# Vivado block design bd_0cc7, xc7z010clg400-1, Vivado 2020.2
# (continued, part 2 of 2)
current_bd_instance /m01_nodes

# ---- hierarchy /m01_exit_pipeline ----
current_bd_instance /m01_exit_pipeline
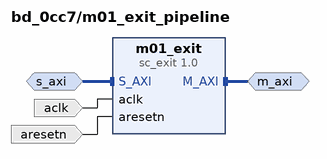
[diagram p9: block diagram inside /m01_exit_pipeline]
create_bd_intf_pin -mode Slave -vlnv xilinx.com:interface:aximm_rtl:1.0 s_axi
create_bd_intf_pin -mode Master -vlnv xilinx.com:interface:aximm_rtl:1.0 m_axi
create_bd_pin -dir I -type clk aclk
create_bd_pin -dir I -type rst aresetn

create_bd_cell -type ip -vlnv xilinx.com:ip:sc_exit:1.0 m01_exit
set_property -dict [list \
  CONFIG.ADDR_WIDTH 12 \
  CONFIG.ENABLE_PIPELINING 0 \
  CONFIG.HAS_BURST 0 \
  CONFIG.IS_CASCADED 0 \
  CONFIG.MEP_IDENTIFIER_WIDTH 1 \
  CONFIG.M_MAX_BURST_LENGTH 0 \
  CONFIG.M_PROTOCOL AXI4LITE \
  CONFIG.NUM_MSC 3 \
  CONFIG.NUM_READ_OUTSTANDING 8 \
  CONFIG.NUM_WRITE_OUTSTANDING 8 \
  CONFIG.RDATA_WIDTH 32 \
  CONFIG.READ_WRITE_MODE READ_WRITE \
  CONFIG.SINGLE_ISSUING 1 \
  CONFIG.SSC000_ROUTE 0b101 \
  CONFIG.SSC001_ROUTE 0b111 \
  CONFIG.SSC_ROUTE_WIDTH 3 \
  CONFIG.S_ID_WIDTH 1 \
  CONFIG.WDATA_WIDTH 32 \
] [get_bd_cells m01_exit]

# ---- hierarchy /m02_nodes ----
current_bd_instance /m02_nodes
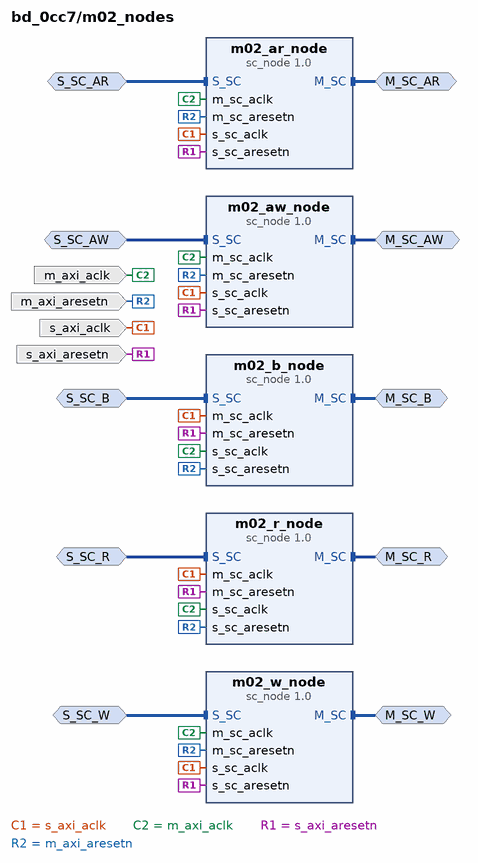
[diagram p10: block diagram inside /m02_nodes]
create_bd_intf_pin -mode Master -vlnv xilinx.com:interface:sc_rtl:1.0 M_SC_AR
create_bd_intf_pin -mode Slave -vlnv xilinx.com:interface:sc_rtl:1.0 S_SC_AR
create_bd_intf_pin -mode Master -vlnv xilinx.com:interface:sc_rtl:1.0 M_SC_R
create_bd_intf_pin -mode Slave -vlnv xilinx.com:interface:sc_rtl:1.0 S_SC_R
create_bd_intf_pin -mode Master -vlnv xilinx.com:interface:sc_rtl:1.0 M_SC_AW
create_bd_intf_pin -mode Slave -vlnv xilinx.com:interface:sc_rtl:1.0 S_SC_AW
create_bd_intf_pin -mode Master -vlnv xilinx.com:interface:sc_rtl:1.0 M_SC_W
create_bd_intf_pin -mode Slave -vlnv xilinx.com:interface:sc_rtl:1.0 S_SC_W
create_bd_intf_pin -mode Master -vlnv xilinx.com:interface:sc_rtl:1.0 M_SC_B
create_bd_intf_pin -mode Slave -vlnv xilinx.com:interface:sc_rtl:1.0 S_SC_B
create_bd_pin -dir I -type clk s_axi_aclk
create_bd_pin -dir I -type rst s_axi_aresetn
create_bd_pin -dir I -type clk m_axi_aclk
create_bd_pin -dir I -type rst m_axi_aresetn

create_bd_cell -type ip -vlnv xilinx.com:ip:sc_node:1.0 m02_ar_node
set_property -dict [list \
  CONFIG.ACLK_RELATIONSHIP 1 \
  CONFIG.ADDR_WIDTH 18 \
  CONFIG.CHANNEL 2 \
  CONFIG.FIFO_TYPE 2 \
  CONFIG.ID_WIDTH 1 \
  CONFIG.M00_NUM_BYTES 4 \
  CONFIG.M01_NUM_BYTES 4 \
  CONFIG.M02_NUM_BYTES 4 \
  CONFIG.M03_NUM_BYTES 4 \
  CONFIG.M04_NUM_BYTES 4 \
  CONFIG.M05_NUM_BYTES 4 \
  CONFIG.M06_NUM_BYTES 4 \
  CONFIG.M07_NUM_BYTES 4 \
  CONFIG.M08_NUM_BYTES 4 \
  CONFIG.M09_NUM_BYTES 4 \
  CONFIG.M10_NUM_BYTES 4 \
  CONFIG.M11_NUM_BYTES 4 \
  CONFIG.M12_NUM_BYTES 4 \
  CONFIG.M13_NUM_BYTES 4 \
  CONFIG.M14_NUM_BYTES 4 \
  CONFIG.M15_NUM_BYTES 4 \
  CONFIG.MAX_PAYLD_BYTES 4 \
  CONFIG.M_SEND_PIPELINE 0 \
  CONFIG.NUM_MI 1 \
  CONFIG.NUM_OUTSTANDING 8 \
  CONFIG.NUM_SI 1 \
  CONFIG.PAYLD_WIDTH 128 \
  CONFIG.S00_NUM_BYTES 4 \
  CONFIG.S01_NUM_BYTES 4 \
  CONFIG.S02_NUM_BYTES 4 \
  CONFIG.S03_NUM_BYTES 4 \
  CONFIG.S04_NUM_BYTES 4 \
  CONFIG.S05_NUM_BYTES 4 \
  CONFIG.S06_NUM_BYTES 4 \
  CONFIG.S07_NUM_BYTES 4 \
  CONFIG.S08_NUM_BYTES 4 \
  CONFIG.S09_NUM_BYTES 4 \
  CONFIG.S10_NUM_BYTES 4 \
  CONFIG.S11_NUM_BYTES 4 \
  CONFIG.S12_NUM_BYTES 4 \
  CONFIG.S13_NUM_BYTES 4 \
  CONFIG.S14_NUM_BYTES 4 \
  CONFIG.S15_NUM_BYTES 4 \
  CONFIG.SC_ROUTE_WIDTH 5 \
  CONFIG.USER_WIDTH 0 \
] [get_bd_cells m02_ar_node]
create_bd_cell -type ip -vlnv xilinx.com:ip:sc_node:1.0 m02_r_node
set_property -dict [list \
  CONFIG.ACLK_RELATIONSHIP 1 \
  CONFIG.ADDR_WIDTH 18 \
  CONFIG.CHANNEL 0 \
  CONFIG.FIFO_TYPE 2 \
  CONFIG.ID_WIDTH 1 \
  CONFIG.M00_NUM_BYTES 4 \
  CONFIG.M01_NUM_BYTES 4 \
  CONFIG.M02_NUM_BYTES 4 \
  CONFIG.M03_NUM_BYTES 4 \
  CONFIG.M04_NUM_BYTES 4 \
  CONFIG.M05_NUM_BYTES 4 \
  CONFIG.M06_NUM_BYTES 4 \
  CONFIG.M07_NUM_BYTES 4 \
  CONFIG.M08_NUM_BYTES 4 \
  CONFIG.M09_NUM_BYTES 4 \
  CONFIG.M10_NUM_BYTES 4 \
  CONFIG.M11_NUM_BYTES 4 \
  CONFIG.M12_NUM_BYTES 4 \
  CONFIG.M13_NUM_BYTES 4 \
  CONFIG.M14_NUM_BYTES 4 \
  CONFIG.M15_NUM_BYTES 4 \
  CONFIG.MAX_PAYLD_BYTES 4 \
  CONFIG.NUM_MI 1 \
  CONFIG.NUM_OUTSTANDING 8 \
  CONFIG.NUM_SI 1 \
  CONFIG.PAYLD_WIDTH 53 \
  CONFIG.S00_NUM_BYTES 4 \
  CONFIG.S01_NUM_BYTES 4 \
  CONFIG.S02_NUM_BYTES 4 \
  CONFIG.S03_NUM_BYTES 4 \
  CONFIG.S04_NUM_BYTES 4 \
  CONFIG.S05_NUM_BYTES 4 \
  CONFIG.S06_NUM_BYTES 4 \
  CONFIG.S07_NUM_BYTES 4 \
  CONFIG.S08_NUM_BYTES 4 \
  CONFIG.S09_NUM_BYTES 4 \
  CONFIG.S10_NUM_BYTES 4 \
  CONFIG.S11_NUM_BYTES 4 \
  CONFIG.S12_NUM_BYTES 4 \
  CONFIG.S13_NUM_BYTES 4 \
  CONFIG.S14_NUM_BYTES 4 \
  CONFIG.S15_NUM_BYTES 4 \
  CONFIG.SC_ROUTE_WIDTH 3 \
  CONFIG.USER_BITS_PER_BYTE 0 \
  CONFIG.USER_WIDTH 0 \
] [get_bd_cells m02_r_node]
create_bd_cell -type ip -vlnv xilinx.com:ip:sc_node:1.0 m02_aw_node
set_property -dict [list \
  CONFIG.ACLK_RELATIONSHIP 1 \
  CONFIG.ADDR_WIDTH 18 \
  CONFIG.CHANNEL 3 \
  CONFIG.FIFO_TYPE 2 \
  CONFIG.ID_WIDTH 1 \
  CONFIG.M00_NUM_BYTES 4 \
  CONFIG.M01_NUM_BYTES 4 \
  CONFIG.M02_NUM_BYTES 4 \
  CONFIG.M03_NUM_BYTES 4 \
  CONFIG.M04_NUM_BYTES 4 \
  CONFIG.M05_NUM_BYTES 4 \
  CONFIG.M06_NUM_BYTES 4 \
  CONFIG.M07_NUM_BYTES 4 \
  CONFIG.M08_NUM_BYTES 4 \
  CONFIG.M09_NUM_BYTES 4 \
  CONFIG.M10_NUM_BYTES 4 \
  CONFIG.M11_NUM_BYTES 4 \
  CONFIG.M12_NUM_BYTES 4 \
  CONFIG.M13_NUM_BYTES 4 \
  CONFIG.M14_NUM_BYTES 4 \
  CONFIG.M15_NUM_BYTES 4 \
  CONFIG.MAX_PAYLD_BYTES 4 \
  CONFIG.M_SEND_PIPELINE 0 \
  CONFIG.NUM_MI 1 \
  CONFIG.NUM_OUTSTANDING 8 \
  CONFIG.NUM_SI 1 \
  CONFIG.PAYLD_WIDTH 128 \
  CONFIG.S00_NUM_BYTES 4 \
  CONFIG.S01_NUM_BYTES 4 \
  CONFIG.S02_NUM_BYTES 4 \
  CONFIG.S03_NUM_BYTES 4 \
  CONFIG.S04_NUM_BYTES 4 \
  CONFIG.S05_NUM_BYTES 4 \
  CONFIG.S06_NUM_BYTES 4 \
  CONFIG.S07_NUM_BYTES 4 \
  CONFIG.S08_NUM_BYTES 4 \
  CONFIG.S09_NUM_BYTES 4 \
  CONFIG.S10_NUM_BYTES 4 \
  CONFIG.S11_NUM_BYTES 4 \
  CONFIG.S12_NUM_BYTES 4 \
  CONFIG.S13_NUM_BYTES 4 \
  CONFIG.S14_NUM_BYTES 4 \
  CONFIG.S15_NUM_BYTES 4 \
  CONFIG.SC_ROUTE_WIDTH 5 \
  CONFIG.USER_WIDTH 0 \
] [get_bd_cells m02_aw_node]
create_bd_cell -type ip -vlnv xilinx.com:ip:sc_node:1.0 m02_w_node
set_property -dict [list \
  CONFIG.ACLK_RELATIONSHIP 1 \
  CONFIG.ADDR_WIDTH 18 \
  CONFIG.CHANNEL 1 \
  CONFIG.FIFO_TYPE 2 \
  CONFIG.ID_WIDTH 1 \
  CONFIG.M00_NUM_BYTES 4 \
  CONFIG.M01_NUM_BYTES 4 \
  CONFIG.M02_NUM_BYTES 4 \
  CONFIG.M03_NUM_BYTES 4 \
  CONFIG.M04_NUM_BYTES 4 \
  CONFIG.M05_NUM_BYTES 4 \
  CONFIG.M06_NUM_BYTES 4 \
  CONFIG.M07_NUM_BYTES 4 \
  CONFIG.M08_NUM_BYTES 4 \
  CONFIG.M09_NUM_BYTES 4 \
  CONFIG.M10_NUM_BYTES 4 \
  CONFIG.M11_NUM_BYTES 4 \
  CONFIG.M12_NUM_BYTES 4 \
  CONFIG.M13_NUM_BYTES 4 \
  CONFIG.M14_NUM_BYTES 4 \
  CONFIG.M15_NUM_BYTES 4 \
  CONFIG.MAX_PAYLD_BYTES 4 \
  CONFIG.M_SEND_PIPELINE 0 \
  CONFIG.NUM_MI 1 \
  CONFIG.NUM_OUTSTANDING 8 \
  CONFIG.NUM_SI 1 \
  CONFIG.PAYLD_WIDTH 56 \
  CONFIG.S00_NUM_BYTES 4 \
  CONFIG.S01_NUM_BYTES 4 \
  CONFIG.S02_NUM_BYTES 4 \
  CONFIG.S03_NUM_BYTES 4 \
  CONFIG.S04_NUM_BYTES 4 \
  CONFIG.S05_NUM_BYTES 4 \
  CONFIG.S06_NUM_BYTES 4 \
  CONFIG.S07_NUM_BYTES 4 \
  CONFIG.S08_NUM_BYTES 4 \
  CONFIG.S09_NUM_BYTES 4 \
  CONFIG.S10_NUM_BYTES 4 \
  CONFIG.S11_NUM_BYTES 4 \
  CONFIG.S12_NUM_BYTES 4 \
  CONFIG.S13_NUM_BYTES 4 \
  CONFIG.S14_NUM_BYTES 4 \
  CONFIG.S15_NUM_BYTES 4 \
  CONFIG.SC_ROUTE_WIDTH 5 \
  CONFIG.USER_BITS_PER_BYTE 0 \
  CONFIG.USER_WIDTH 0 \
] [get_bd_cells m02_w_node]
create_bd_cell -type ip -vlnv xilinx.com:ip:sc_node:1.0 m02_b_node
set_property -dict [list \
  CONFIG.ACLK_RELATIONSHIP 1 \
  CONFIG.ADDR_WIDTH 18 \
  CONFIG.CHANNEL 4 \
  CONFIG.FIFO_TYPE 2 \
  CONFIG.ID_WIDTH 1 \
  CONFIG.M00_NUM_BYTES 4 \
  CONFIG.M01_NUM_BYTES 4 \
  CONFIG.M02_NUM_BYTES 4 \
  CONFIG.M03_NUM_BYTES 4 \
  CONFIG.M04_NUM_BYTES 4 \
  CONFIG.M05_NUM_BYTES 4 \
  CONFIG.M06_NUM_BYTES 4 \
  CONFIG.M07_NUM_BYTES 4 \
  CONFIG.M08_NUM_BYTES 4 \
  CONFIG.M09_NUM_BYTES 4 \
  CONFIG.M10_NUM_BYTES 4 \
  CONFIG.M11_NUM_BYTES 4 \
  CONFIG.M12_NUM_BYTES 4 \
  CONFIG.M13_NUM_BYTES 4 \
  CONFIG.M14_NUM_BYTES 4 \
  CONFIG.M15_NUM_BYTES 4 \
  CONFIG.MAX_PAYLD_BYTES 4 \
  CONFIG.NUM_MI 1 \
  CONFIG.NUM_OUTSTANDING 8 \
  CONFIG.NUM_SI 1 \
  CONFIG.PAYLD_WIDTH 7 \
  CONFIG.S00_NUM_BYTES 4 \
  CONFIG.S01_NUM_BYTES 4 \
  CONFIG.S02_NUM_BYTES 4 \
  CONFIG.S03_NUM_BYTES 4 \
  CONFIG.S04_NUM_BYTES 4 \
  CONFIG.S05_NUM_BYTES 4 \
  CONFIG.S06_NUM_BYTES 4 \
  CONFIG.S07_NUM_BYTES 4 \
  CONFIG.S08_NUM_BYTES 4 \
  CONFIG.S09_NUM_BYTES 4 \
  CONFIG.S10_NUM_BYTES 4 \
  CONFIG.S11_NUM_BYTES 4 \
  CONFIG.S12_NUM_BYTES 4 \
  CONFIG.S13_NUM_BYTES 4 \
  CONFIG.S14_NUM_BYTES 4 \
  CONFIG.S15_NUM_BYTES 4 \
  CONFIG.SC_ROUTE_WIDTH 3 \
  CONFIG.USER_WIDTH 0 \
] [get_bd_cells m02_b_node]

# ---- hierarchy /m02_exit_pipeline ----
current_bd_instance /m02_exit_pipeline
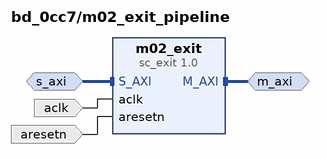
[diagram p11: block diagram inside /m02_exit_pipeline]
create_bd_intf_pin -mode Slave -vlnv xilinx.com:interface:aximm_rtl:1.0 s_axi
create_bd_intf_pin -mode Master -vlnv xilinx.com:interface:aximm_rtl:1.0 m_axi
create_bd_pin -dir I -type clk aclk
create_bd_pin -dir I -type rst aresetn

create_bd_cell -type ip -vlnv xilinx.com:ip:sc_exit:1.0 m02_exit
set_property -dict [list \
  CONFIG.ADDR_WIDTH 9 \
  CONFIG.ENABLE_PIPELINING 0 \
  CONFIG.HAS_BURST 0 \
  CONFIG.IS_CASCADED 0 \
  CONFIG.MEP_IDENTIFIER_WIDTH 1 \
  CONFIG.M_MAX_BURST_LENGTH 0 \
  CONFIG.M_PROTOCOL AXI4LITE \
  CONFIG.NUM_MSC 3 \
  CONFIG.NUM_READ_OUTSTANDING 8 \
  CONFIG.NUM_WRITE_OUTSTANDING 8 \
  CONFIG.RDATA_WIDTH 32 \
  CONFIG.READ_WRITE_MODE READ_WRITE \
  CONFIG.SINGLE_ISSUING 1 \
  CONFIG.SSC000_ROUTE 0b101 \
  CONFIG.SSC001_ROUTE 0b111 \
  CONFIG.SSC_ROUTE_WIDTH 3 \
  CONFIG.S_ID_WIDTH 1 \
  CONFIG.WDATA_WIDTH 32 \
] [get_bd_cells m02_exit]

# ---- connections ----

current_bd_instance /clk_map
connect_bd_net -net clk_map_aresetn_net [get_bd_pins aresetn] [get_bd_pins psr_aclk/aux_reset_in]
connect_bd_net -net clk_map_aclk_net [get_bd_pins aclk] \
  [get_bd_pins S00_ACLK] [get_bd_pins M00_ACLK] [get_bd_pins M01_ACLK] [get_bd_pins M02_ACLK] [get_bd_pins swbd_aclk] \
  [get_bd_pins psr_aclk/slowest_sync_clk]
connect_bd_net [get_bd_pins psr_aclk/interconnect_aresetn] \
  [get_bd_pins S00_ARESETN] [get_bd_pins M00_ARESETN] [get_bd_pins M01_ARESETN] [get_bd_pins M02_ARESETN] \
  [get_bd_pins swbd_aresetn]
connect_bd_net [get_bd_pins one/dout] [get_bd_pins psr_aclk/ext_reset_in]

current_bd_instance /switchboards
connect_bd_intf_net [get_bd_intf_pins M00_SC_AW] [get_bd_intf_pins aw_la_out_swbd/M00_SC]
connect_bd_intf_net [get_bd_intf_pins S00_SC_AR] [get_bd_intf_pins ar_la_in_swbd/S00_SC]
connect_bd_intf_net [get_bd_intf_pins M00_SC_R] [get_bd_intf_pins r_la_in_swbd/M00_SC]
connect_bd_intf_net [get_bd_intf_pins M00_SC_AR] [get_bd_intf_pins ar_la_out_swbd/M00_SC]
connect_bd_intf_net [get_bd_intf_pins M02_SC_AR] [get_bd_intf_pins ar_la_out_swbd/M02_SC]
connect_bd_intf_net [get_bd_intf_pins M01_SC_AR] [get_bd_intf_pins ar_la_out_swbd/M01_SC]
connect_bd_intf_net [get_bd_intf_pins S00_SC_W] [get_bd_intf_pins w_la_in_swbd/S00_SC]
connect_bd_intf_net [get_bd_intf_pins S00_SC_AW] [get_bd_intf_pins aw_la_in_swbd/S00_SC]
connect_bd_intf_net [get_bd_intf_pins M00_SC_B] [get_bd_intf_pins b_la_in_swbd/M00_SC]
connect_bd_intf_net [get_bd_intf_pins M01_SC_AW] [get_bd_intf_pins aw_la_out_swbd/M01_SC]
connect_bd_intf_net [get_bd_intf_pins M02_SC_W] [get_bd_intf_pins w_la_out_swbd/M02_SC]
connect_bd_intf_net [get_bd_intf_pins S00_SC_B] [get_bd_intf_pins b_la_out_swbd/S00_SC]
connect_bd_intf_net [get_bd_intf_pins S02_SC_B] [get_bd_intf_pins b_la_out_swbd/S02_SC]
connect_bd_intf_net [get_bd_intf_pins S01_SC_B] [get_bd_intf_pins b_la_out_swbd/S01_SC]
connect_bd_intf_net [get_bd_intf_pins S00_SC_R] [get_bd_intf_pins r_la_out_swbd/S00_SC]
connect_bd_intf_net [get_bd_intf_pins S01_SC_R] [get_bd_intf_pins r_la_out_swbd/S01_SC]
connect_bd_intf_net [get_bd_intf_pins M02_SC_AW] [get_bd_intf_pins aw_la_out_swbd/M02_SC]
connect_bd_intf_net [get_bd_intf_pins S02_SC_R] [get_bd_intf_pins r_la_out_swbd/S02_SC]
connect_bd_intf_net [get_bd_intf_pins M00_SC_W] [get_bd_intf_pins w_la_out_swbd/M00_SC]
connect_bd_intf_net [get_bd_intf_pins M01_SC_W] [get_bd_intf_pins w_la_out_swbd/M01_SC]
connect_bd_intf_net [get_bd_intf_pins b_la_out_swbd/M00_SC] [get_bd_intf_pins i_nodes/S_SC_B]
connect_bd_intf_net [get_bd_intf_pins r_la_in_swbd/S00_SC] [get_bd_intf_pins i_nodes/M_SC_R]
connect_bd_intf_net [get_bd_intf_pins b_la_in_swbd/S00_SC] [get_bd_intf_pins i_nodes/M_SC_B]
connect_bd_intf_net [get_bd_intf_pins r_la_out_swbd/M00_SC] [get_bd_intf_pins i_nodes/S_SC_R]
connect_bd_intf_net [get_bd_intf_pins aw_la_in_swbd/M00_SC] [get_bd_intf_pins i_nodes/S_SC_AW]
connect_bd_intf_net [get_bd_intf_pins w_la_out_swbd/S00_SC] [get_bd_intf_pins i_nodes/M_SC_W]
connect_bd_intf_net [get_bd_intf_pins ar_la_out_swbd/S00_SC] [get_bd_intf_pins i_nodes/M_SC_AR]
connect_bd_intf_net [get_bd_intf_pins ar_la_in_swbd/M00_SC] [get_bd_intf_pins i_nodes/S_SC_AR]
connect_bd_intf_net [get_bd_intf_pins aw_la_out_swbd/S00_SC] [get_bd_intf_pins i_nodes/M_SC_AW]
connect_bd_intf_net [get_bd_intf_pins w_la_in_swbd/M00_SC] [get_bd_intf_pins i_nodes/S_SC_W]
connect_bd_net [get_bd_pins s_sc_aclk] \
  [get_bd_pins i_nodes/s_sc_aclk] [get_bd_pins ar_la_in_swbd/aclk] [get_bd_pins aw_la_in_swbd/aclk] \
  [get_bd_pins b_la_in_swbd/aclk] [get_bd_pins r_la_in_swbd/aclk] [get_bd_pins w_la_in_swbd/aclk]
connect_bd_net [get_bd_pins m_sc_aclk] \
  [get_bd_pins i_nodes/m_sc_aclk] [get_bd_pins ar_la_out_swbd/aclk] [get_bd_pins aw_la_out_swbd/aclk] \
  [get_bd_pins b_la_out_swbd/aclk] [get_bd_pins r_la_out_swbd/aclk] [get_bd_pins w_la_out_swbd/aclk]
connect_bd_net [get_bd_pins s_sc_aresetn] [get_bd_pins i_nodes/s_sc_aresetn]
connect_bd_net [get_bd_pins m_sc_aresetn] [get_bd_pins i_nodes/m_sc_aresetn]

current_bd_instance /switchboards/i_nodes
connect_bd_intf_net [get_bd_intf_pins M_SC_R] [get_bd_intf_pins i_r_node/M_SC]
connect_bd_intf_net [get_bd_intf_pins M_SC_AR] [get_bd_intf_pins i_ar_node/M_SC]
connect_bd_intf_net [get_bd_intf_pins S_SC_AR] [get_bd_intf_pins i_ar_node/S_SC]
connect_bd_intf_net [get_bd_intf_pins S_SC_R] [get_bd_intf_pins i_r_node/S_SC]
connect_bd_intf_net [get_bd_intf_pins S_SC_AW] [get_bd_intf_pins i_aw_node/S_SC]
connect_bd_intf_net [get_bd_intf_pins S_SC_W] [get_bd_intf_pins i_w_node/S_SC]
connect_bd_intf_net [get_bd_intf_pins S_SC_B] [get_bd_intf_pins i_b_node/S_SC]
connect_bd_intf_net [get_bd_intf_pins M_SC_W] [get_bd_intf_pins i_w_node/M_SC]
connect_bd_intf_net [get_bd_intf_pins M_SC_AW] [get_bd_intf_pins i_aw_node/M_SC]
connect_bd_intf_net [get_bd_intf_pins M_SC_B] [get_bd_intf_pins i_b_node/M_SC]
connect_bd_net [get_bd_pins s_sc_aclk] \
  [get_bd_pins i_aw_node/s_sc_aclk] [get_bd_pins i_w_node/s_sc_aclk] [get_bd_pins i_ar_node/s_sc_aclk] \
  [get_bd_pins i_r_node/m_sc_aclk] [get_bd_pins i_b_node/m_sc_aclk]
connect_bd_net [get_bd_pins m_sc_aclk] \
  [get_bd_pins i_aw_node/m_sc_aclk] [get_bd_pins i_ar_node/m_sc_aclk] [get_bd_pins i_w_node/m_sc_aclk] \
  [get_bd_pins i_r_node/s_sc_aclk] [get_bd_pins i_b_node/s_sc_aclk]
connect_bd_net [get_bd_pins s_sc_aresetn] \
  [get_bd_pins i_aw_node/s_sc_aresetn] [get_bd_pins i_w_node/s_sc_aresetn] [get_bd_pins i_ar_node/s_sc_aresetn] \
  [get_bd_pins i_r_node/m_sc_aresetn] [get_bd_pins i_b_node/m_sc_aresetn]
connect_bd_net [get_bd_pins m_sc_aresetn] \
  [get_bd_pins i_aw_node/m_sc_aresetn] [get_bd_pins i_ar_node/m_sc_aresetn] [get_bd_pins i_w_node/m_sc_aresetn] \
  [get_bd_pins i_r_node/s_sc_aresetn] [get_bd_pins i_b_node/s_sc_aresetn]

current_bd_instance /s00_entry_pipeline
connect_bd_intf_net [get_bd_intf_pins s00_mmu/M_AXI] [get_bd_intf_pins s00_transaction_regulator/S_AXI]
connect_bd_intf_net [get_bd_intf_pins s00_transaction_regulator/M_AXI] [get_bd_intf_pins s00_si_converter/S_AXI]
connect_bd_intf_net [get_bd_intf_pins s_axi] [get_bd_intf_pins s00_mmu/S_AXI]
connect_bd_intf_net [get_bd_intf_pins m_axi] [get_bd_intf_pins s00_si_converter/M_AXI]
connect_bd_net [get_bd_pins aclk] [get_bd_pins s00_mmu/aclk] [get_bd_pins s00_si_converter/aclk] [get_bd_pins s00_transaction_regulator/aclk]
connect_bd_net [get_bd_pins aresetn] \
  [get_bd_pins s00_mmu/aresetn] [get_bd_pins s00_si_converter/aresetn] [get_bd_pins s00_transaction_regulator/aresetn]

current_bd_instance /s00_nodes
connect_bd_intf_net [get_bd_intf_pins S_SC_AR] [get_bd_intf_pins s00_ar_node/S_SC]
connect_bd_intf_net [get_bd_intf_pins M_SC_AR] [get_bd_intf_pins s00_ar_node/M_SC]
connect_bd_intf_net [get_bd_intf_pins M_SC_R] [get_bd_intf_pins s00_r_node/M_SC]
connect_bd_intf_net [get_bd_intf_pins M_SC_AW] [get_bd_intf_pins s00_aw_node/M_SC]
connect_bd_intf_net [get_bd_intf_pins S_SC_AW] [get_bd_intf_pins s00_aw_node/S_SC]
connect_bd_intf_net [get_bd_intf_pins S_SC_R] [get_bd_intf_pins s00_r_node/S_SC]
connect_bd_intf_net [get_bd_intf_pins M_SC_B] [get_bd_intf_pins s00_b_node/M_SC]
connect_bd_intf_net [get_bd_intf_pins S_SC_W] [get_bd_intf_pins s00_w_node/S_SC]
connect_bd_intf_net [get_bd_intf_pins M_SC_W] [get_bd_intf_pins s00_w_node/M_SC]
connect_bd_intf_net [get_bd_intf_pins S_SC_B] [get_bd_intf_pins s00_b_node/S_SC]
connect_bd_net [get_bd_pins s_sc_clk] \
  [get_bd_pins s00_ar_node/s_sc_aclk] [get_bd_pins s00_aw_node/s_sc_aclk] [get_bd_pins s00_w_node/s_sc_aclk] \
  [get_bd_pins s00_r_node/m_sc_aclk] [get_bd_pins s00_b_node/m_sc_aclk]
connect_bd_net [get_bd_pins m_sc_clk] \
  [get_bd_pins s00_ar_node/m_sc_aclk] [get_bd_pins s00_aw_node/m_sc_aclk] [get_bd_pins s00_w_node/m_sc_aclk] \
  [get_bd_pins s00_r_node/s_sc_aclk] [get_bd_pins s00_b_node/s_sc_aclk]
connect_bd_net [get_bd_pins s_sc_resetn] \
  [get_bd_pins s00_ar_node/s_sc_aresetn] [get_bd_pins s00_aw_node/s_sc_aresetn] [get_bd_pins s00_w_node/s_sc_aresetn] \
  [get_bd_pins s00_r_node/m_sc_aresetn] [get_bd_pins s00_b_node/m_sc_aresetn]
connect_bd_net [get_bd_pins m_sc_resetn] \
  [get_bd_pins s00_ar_node/m_sc_aresetn] [get_bd_pins s00_aw_node/m_sc_aresetn] [get_bd_pins s00_w_node/m_sc_aresetn] \
  [get_bd_pins s00_r_node/s_sc_aresetn] [get_bd_pins s00_b_node/s_sc_aresetn]

current_bd_instance /m00_nodes
connect_bd_intf_net [get_bd_intf_pins S_SC_AR] [get_bd_intf_pins m00_ar_node/S_SC]
connect_bd_intf_net [get_bd_intf_pins M_SC_AR] [get_bd_intf_pins m00_ar_node/M_SC]
connect_bd_intf_net [get_bd_intf_pins M_SC_AW] [get_bd_intf_pins m00_aw_node/M_SC]
connect_bd_intf_net [get_bd_intf_pins S_SC_R] [get_bd_intf_pins m00_r_node/S_SC]
connect_bd_intf_net [get_bd_intf_pins S_SC_AW] [get_bd_intf_pins m00_aw_node/S_SC]
connect_bd_intf_net [get_bd_intf_pins M_SC_R] [get_bd_intf_pins m00_r_node/M_SC]
connect_bd_intf_net [get_bd_intf_pins M_SC_W] [get_bd_intf_pins m00_w_node/M_SC]
connect_bd_intf_net [get_bd_intf_pins S_SC_B] [get_bd_intf_pins m00_b_node/S_SC]
connect_bd_intf_net [get_bd_intf_pins M_SC_B] [get_bd_intf_pins m00_b_node/M_SC]
connect_bd_intf_net [get_bd_intf_pins S_SC_W] [get_bd_intf_pins m00_w_node/S_SC]
connect_bd_net [get_bd_pins s_axi_aclk] \
  [get_bd_pins m00_ar_node/s_sc_aclk] [get_bd_pins m00_aw_node/s_sc_aclk] [get_bd_pins m00_w_node/s_sc_aclk] \
  [get_bd_pins m00_r_node/m_sc_aclk] [get_bd_pins m00_b_node/m_sc_aclk]
connect_bd_net [get_bd_pins m_axi_aclk] \
  [get_bd_pins m00_ar_node/m_sc_aclk] [get_bd_pins m00_aw_node/m_sc_aclk] [get_bd_pins m00_w_node/m_sc_aclk] \
  [get_bd_pins m00_r_node/s_sc_aclk] [get_bd_pins m00_b_node/s_sc_aclk]
connect_bd_net [get_bd_pins s_axi_aresetn] \
  [get_bd_pins m00_ar_node/s_sc_aresetn] [get_bd_pins m00_aw_node/s_sc_aresetn] [get_bd_pins m00_w_node/s_sc_aresetn] \
  [get_bd_pins m00_r_node/m_sc_aresetn] [get_bd_pins m00_b_node/m_sc_aresetn]
connect_bd_net [get_bd_pins m_axi_aresetn] \
  [get_bd_pins m00_ar_node/m_sc_aresetn] [get_bd_pins m00_aw_node/m_sc_aresetn] [get_bd_pins m00_w_node/m_sc_aresetn] \
  [get_bd_pins m00_r_node/s_sc_aresetn] [get_bd_pins m00_b_node/s_sc_aresetn]

current_bd_instance /m00_exit_pipeline
connect_bd_intf_net [get_bd_intf_pins m_axi] [get_bd_intf_pins m00_exit/M_AXI]
connect_bd_intf_net [get_bd_intf_pins s_axi] [get_bd_intf_pins m00_exit/S_AXI]
connect_bd_net [get_bd_pins aclk] [get_bd_pins m00_exit/aclk]
connect_bd_net [get_bd_pins aresetn] [get_bd_pins m00_exit/aresetn]

current_bd_instance /m01_nodes
connect_bd_intf_net [get_bd_intf_pins M_SC_AR] [get_bd_intf_pins m01_ar_node/M_SC]
connect_bd_intf_net [get_bd_intf_pins S_SC_AR] [get_bd_intf_pins m01_ar_node/S_SC]
connect_bd_intf_net [get_bd_intf_pins M_SC_R] [get_bd_intf_pins m01_r_node/M_SC]
connect_bd_intf_net [get_bd_intf_pins S_SC_AW] [get_bd_intf_pins m01_aw_node/S_SC]
connect_bd_intf_net [get_bd_intf_pins S_SC_R] [get_bd_intf_pins m01_r_node/S_SC]
connect_bd_intf_net [get_bd_intf_pins M_SC_AW] [get_bd_intf_pins m01_aw_node/M_SC]
connect_bd_intf_net [get_bd_intf_pins S_SC_W] [get_bd_intf_pins m01_w_node/S_SC]
connect_bd_intf_net [get_bd_intf_pins M_SC_B] [get_bd_intf_pins m01_b_node/M_SC]
connect_bd_intf_net [get_bd_intf_pins M_SC_W] [get_bd_intf_pins m01_w_node/M_SC]
connect_bd_intf_net [get_bd_intf_pins S_SC_B] [get_bd_intf_pins m01_b_node/S_SC]
connect_bd_net [get_bd_pins s_axi_aclk] \
  [get_bd_pins m01_ar_node/s_sc_aclk] [get_bd_pins m01_aw_node/s_sc_aclk] [get_bd_pins m01_w_node/s_sc_aclk] \
  [get_bd_pins m01_r_node/m_sc_aclk] [get_bd_pins m01_b_node/m_sc_aclk]
connect_bd_net [get_bd_pins m_axi_aclk] \
  [get_bd_pins m01_ar_node/m_sc_aclk] [get_bd_pins m01_aw_node/m_sc_aclk] [get_bd_pins m01_w_node/m_sc_aclk] \
  [get_bd_pins m01_r_node/s_sc_aclk] [get_bd_pins m01_b_node/s_sc_aclk]
connect_bd_net [get_bd_pins s_axi_aresetn] \
  [get_bd_pins m01_ar_node/s_sc_aresetn] [get_bd_pins m01_aw_node/s_sc_aresetn] [get_bd_pins m01_w_node/s_sc_aresetn] \
  [get_bd_pins m01_r_node/m_sc_aresetn] [get_bd_pins m01_b_node/m_sc_aresetn]
connect_bd_net [get_bd_pins m_axi_aresetn] \
  [get_bd_pins m01_ar_node/m_sc_aresetn] [get_bd_pins m01_aw_node/m_sc_aresetn] [get_bd_pins m01_w_node/m_sc_aresetn] \
  [get_bd_pins m01_r_node/s_sc_aresetn] [get_bd_pins m01_b_node/s_sc_aresetn]

current_bd_instance /m01_exit_pipeline
connect_bd_intf_net [get_bd_intf_pins m_axi] [get_bd_intf_pins m01_exit/M_AXI]
connect_bd_intf_net [get_bd_intf_pins s_axi] [get_bd_intf_pins m01_exit/S_AXI]
connect_bd_net [get_bd_pins aclk] [get_bd_pins m01_exit/aclk]
connect_bd_net [get_bd_pins aresetn] [get_bd_pins m01_exit/aresetn]

current_bd_instance /m02_nodes
connect_bd_intf_net [get_bd_intf_pins M_SC_AR] [get_bd_intf_pins m02_ar_node/M_SC]
connect_bd_intf_net [get_bd_intf_pins M_SC_R] [get_bd_intf_pins m02_r_node/M_SC]
connect_bd_intf_net [get_bd_intf_pins S_SC_AR] [get_bd_intf_pins m02_ar_node/S_SC]
connect_bd_intf_net [get_bd_intf_pins S_SC_W] [get_bd_intf_pins m02_w_node/S_SC]
connect_bd_intf_net [get_bd_intf_pins M_SC_AW] [get_bd_intf_pins m02_aw_node/M_SC]
connect_bd_intf_net [get_bd_intf_pins S_SC_AW] [get_bd_intf_pins m02_aw_node/S_SC]
connect_bd_intf_net [get_bd_intf_pins S_SC_R] [get_bd_intf_pins m02_r_node/S_SC]
connect_bd_intf_net [get_bd_intf_pins M_SC_W] [get_bd_intf_pins m02_w_node/M_SC]
connect_bd_intf_net [get_bd_intf_pins S_SC_B] [get_bd_intf_pins m02_b_node/S_SC]
connect_bd_intf_net [get_bd_intf_pins M_SC_B] [get_bd_intf_pins m02_b_node/M_SC]
connect_bd_net [get_bd_pins s_axi_aclk] \
  [get_bd_pins m02_ar_node/s_sc_aclk] [get_bd_pins m02_aw_node/s_sc_aclk] [get_bd_pins m02_w_node/s_sc_aclk] \
  [get_bd_pins m02_r_node/m_sc_aclk] [get_bd_pins m02_b_node/m_sc_aclk]
connect_bd_net [get_bd_pins m_axi_aclk] \
  [get_bd_pins m02_ar_node/m_sc_aclk] [get_bd_pins m02_aw_node/m_sc_aclk] [get_bd_pins m02_w_node/m_sc_aclk] \
  [get_bd_pins m02_r_node/s_sc_aclk] [get_bd_pins m02_b_node/s_sc_aclk]
connect_bd_net [get_bd_pins s_axi_aresetn] \
  [get_bd_pins m02_ar_node/s_sc_aresetn] [get_bd_pins m02_aw_node/s_sc_aresetn] [get_bd_pins m02_w_node/s_sc_aresetn] \
  [get_bd_pins m02_r_node/m_sc_aresetn] [get_bd_pins m02_b_node/m_sc_aresetn]
connect_bd_net [get_bd_pins m_axi_aresetn] \
  [get_bd_pins m02_ar_node/m_sc_aresetn] [get_bd_pins m02_aw_node/m_sc_aresetn] [get_bd_pins m02_w_node/m_sc_aresetn] \
  [get_bd_pins m02_r_node/s_sc_aresetn] [get_bd_pins m02_b_node/s_sc_aresetn]

current_bd_instance /m02_exit_pipeline
connect_bd_intf_net [get_bd_intf_pins s_axi] [get_bd_intf_pins m02_exit/S_AXI]
connect_bd_intf_net [get_bd_intf_pins m_axi] [get_bd_intf_pins m02_exit/M_AXI]
connect_bd_net [get_bd_pins aclk] [get_bd_pins m02_exit/aclk]
connect_bd_net [get_bd_pins aresetn] [get_bd_pins m02_exit/aresetn]

current_bd_instance /
connect_bd_intf_net [get_bd_intf_pins m01_sc2axi/M_AXI] [get_bd_intf_pins m01_exit_pipeline/s_axi]
connect_bd_intf_net [get_bd_intf_pins m01_nodes/S_SC_AR] [get_bd_intf_pins switchboards/M01_SC_AR]
connect_bd_intf_net [get_bd_intf_pins m01_nodes/M_SC_AW] [get_bd_intf_pins m01_sc2axi/S_SC_AW]
connect_bd_intf_net [get_bd_intf_pins m01_nodes/M_SC_AR] [get_bd_intf_pins m01_sc2axi/S_SC_AR]
connect_bd_intf_net [get_bd_intf_pins m01_nodes/M_SC_W] [get_bd_intf_pins m01_sc2axi/S_SC_W]
connect_bd_intf_net [get_bd_intf_pins m01_nodes/S_SC_B] [get_bd_intf_pins m01_sc2axi/M_SC_B]
connect_bd_intf_net [get_bd_intf_pins m01_nodes/M_SC_R] [get_bd_intf_pins switchboards/S01_SC_R]
connect_bd_intf_net [get_bd_intf_pins m01_nodes/S_SC_R] [get_bd_intf_pins m01_sc2axi/M_SC_R]
connect_bd_intf_net [get_bd_intf_pins m01_nodes/M_SC_B] [get_bd_intf_pins switchboards/S01_SC_B]
connect_bd_intf_net [get_bd_intf_pins m01_nodes/S_SC_W] [get_bd_intf_pins switchboards/M01_SC_W]
connect_bd_intf_net [get_bd_intf_ports M01_AXI] [get_bd_intf_pins m01_exit_pipeline/m_axi]
connect_bd_intf_net [get_bd_intf_pins m01_nodes/S_SC_AW] [get_bd_intf_pins switchboards/M01_SC_AW]
connect_bd_intf_net [get_bd_intf_ports M02_AXI] [get_bd_intf_pins m02_exit_pipeline/m_axi]
connect_bd_intf_net [get_bd_intf_pins m02_nodes/S_SC_AW] [get_bd_intf_pins switchboards/M02_SC_AW]
connect_bd_intf_net [get_bd_intf_pins m02_nodes/M_SC_R] [get_bd_intf_pins switchboards/S02_SC_R]
connect_bd_intf_net [get_bd_intf_pins m02_nodes/M_SC_W] [get_bd_intf_pins m02_sc2axi/S_SC_W]
connect_bd_intf_net [get_bd_intf_pins m02_nodes/S_SC_W] [get_bd_intf_pins switchboards/M02_SC_W]
connect_bd_intf_net [get_bd_intf_pins m02_nodes/M_SC_B] [get_bd_intf_pins switchboards/S02_SC_B]
connect_bd_intf_net [get_bd_intf_pins m02_nodes/S_SC_B] [get_bd_intf_pins m02_sc2axi/M_SC_B]
connect_bd_intf_net [get_bd_intf_pins m02_sc2axi/M_AXI] [get_bd_intf_pins m02_exit_pipeline/s_axi]
connect_bd_intf_net [get_bd_intf_pins m02_nodes/M_SC_AR] [get_bd_intf_pins m02_sc2axi/S_SC_AR]
connect_bd_intf_net [get_bd_intf_pins m02_nodes/M_SC_AW] [get_bd_intf_pins m02_sc2axi/S_SC_AW]
connect_bd_intf_net [get_bd_intf_pins m02_nodes/S_SC_AR] [get_bd_intf_pins switchboards/M02_SC_AR]
connect_bd_intf_net [get_bd_intf_pins m02_nodes/S_SC_R] [get_bd_intf_pins m02_sc2axi/M_SC_R]
connect_bd_intf_net [get_bd_intf_pins m00_nodes/S_SC_AW] [get_bd_intf_pins switchboards/M00_SC_AW]
connect_bd_intf_net [get_bd_intf_ports M00_AXI] [get_bd_intf_pins m00_exit_pipeline/m_axi]
connect_bd_intf_net [get_bd_intf_pins m00_nodes/S_SC_AR] [get_bd_intf_pins switchboards/M00_SC_AR]
connect_bd_intf_net [get_bd_intf_pins m00_nodes/M_SC_R] [get_bd_intf_pins switchboards/S00_SC_R]
connect_bd_intf_net [get_bd_intf_pins m00_sc2axi/M_AXI] [get_bd_intf_pins m00_exit_pipeline/s_axi]
connect_bd_intf_net [get_bd_intf_pins m00_nodes/M_SC_AW] [get_bd_intf_pins m00_sc2axi/S_SC_AW]
connect_bd_intf_net [get_bd_intf_pins m00_nodes/S_SC_R] [get_bd_intf_pins m00_sc2axi/M_SC_R]
connect_bd_intf_net [get_bd_intf_pins m00_nodes/M_SC_AR] [get_bd_intf_pins m00_sc2axi/S_SC_AR]
connect_bd_intf_net [get_bd_intf_pins m00_nodes/M_SC_B] [get_bd_intf_pins switchboards/S00_SC_B]
connect_bd_intf_net [get_bd_intf_pins m00_nodes/S_SC_W] [get_bd_intf_pins switchboards/M00_SC_W]
connect_bd_intf_net [get_bd_intf_pins m00_nodes/S_SC_B] [get_bd_intf_pins m00_sc2axi/M_SC_B]
connect_bd_intf_net [get_bd_intf_pins m00_nodes/M_SC_W] [get_bd_intf_pins m00_sc2axi/S_SC_W]
connect_bd_intf_net [get_bd_intf_pins s00_nodes/S_SC_W] [get_bd_intf_pins s00_axi2sc/M_SC_W]
connect_bd_intf_net [get_bd_intf_pins s00_nodes/M_SC_R] [get_bd_intf_pins s00_axi2sc/S_SC_R]
connect_bd_intf_net [get_bd_intf_pins s00_nodes/S_SC_AR] [get_bd_intf_pins s00_axi2sc/M_SC_AR]
connect_bd_intf_net [get_bd_intf_pins s00_nodes/M_SC_AR] [get_bd_intf_pins switchboards/S00_SC_AR]
connect_bd_intf_net [get_bd_intf_pins s00_nodes/M_SC_W] [get_bd_intf_pins switchboards/S00_SC_W]
connect_bd_intf_net [get_bd_intf_pins s00_entry_pipeline/m_axi] [get_bd_intf_pins s00_axi2sc/S_AXI]
connect_bd_intf_net [get_bd_intf_ports S00_AXI] [get_bd_intf_pins s00_entry_pipeline/s_axi]
connect_bd_intf_net [get_bd_intf_pins s00_nodes/S_SC_B] [get_bd_intf_pins switchboards/M00_SC_B]
connect_bd_intf_net [get_bd_intf_pins s00_nodes/M_SC_B] [get_bd_intf_pins s00_axi2sc/S_SC_B]
connect_bd_intf_net [get_bd_intf_pins s00_nodes/M_SC_AW] [get_bd_intf_pins switchboards/S00_SC_AW]
connect_bd_intf_net [get_bd_intf_pins s00_nodes/S_SC_R] [get_bd_intf_pins switchboards/M00_SC_R]
connect_bd_intf_net [get_bd_intf_pins s00_nodes/S_SC_AW] [get_bd_intf_pins s00_axi2sc/M_SC_AW]
connect_bd_net -net aclk_net [get_bd_ports aclk] [get_bd_pins clk_map/aclk]
connect_bd_net -net aclk1_1 [get_bd_ports aclk1] [get_bd_pins clk_map/aclk1]
connect_bd_net [get_bd_ports aresetn] [get_bd_pins clk_map/aresetn]
# net aresetn_net has one end: clk_map/aresetn_out
# net swbd_aclk_net has one end: clk_map/swbd_aclk
# net swbd_aresetn_net has one end: clk_map/swbd_aresetn
connect_bd_net [get_bd_pins clk_map/S00_ACLK] \
  [get_bd_pins switchboards/s_sc_aclk] [get_bd_pins s00_entry_pipeline/aclk] [get_bd_pins s00_axi2sc/aclk] \
  [get_bd_pins s00_nodes/s_sc_clk] [get_bd_pins s00_nodes/m_sc_clk]
connect_bd_net [get_bd_pins clk_map/M00_ACLK] \
  [get_bd_pins switchboards/m_sc_aclk] [get_bd_pins m00_sc2axi/aclk] [get_bd_pins m00_nodes/s_axi_aclk] \
  [get_bd_pins m00_nodes/m_axi_aclk] [get_bd_pins m00_exit_pipeline/aclk] [get_bd_pins m01_nodes/s_axi_aclk] \
  [get_bd_pins m02_nodes/s_axi_aclk]
connect_bd_net [get_bd_pins clk_map/S00_ARESETN] \
  [get_bd_pins switchboards/s_sc_aresetn] [get_bd_pins s00_entry_pipeline/aresetn] [get_bd_pins s00_nodes/s_sc_resetn] \
  [get_bd_pins s00_nodes/m_sc_resetn]
connect_bd_net [get_bd_pins clk_map/M00_ARESETN] \
  [get_bd_pins switchboards/m_sc_aresetn] [get_bd_pins m00_nodes/s_axi_aresetn] [get_bd_pins m00_nodes/m_axi_aresetn] \
  [get_bd_pins m00_exit_pipeline/aresetn] [get_bd_pins m01_nodes/s_axi_aresetn] [get_bd_pins m02_nodes/s_axi_aresetn]
connect_bd_net [get_bd_pins clk_map/M01_ACLK] [get_bd_pins m01_sc2axi/aclk] [get_bd_pins m01_nodes/m_axi_aclk] [get_bd_pins m01_exit_pipeline/aclk]
connect_bd_net -net m_axi_aresetn_1 [get_bd_pins clk_map/M01_ARESETN] [get_bd_pins m01_nodes/m_axi_aresetn] [get_bd_pins m01_exit_pipeline/aresetn]
connect_bd_net [get_bd_pins clk_map/M02_ACLK] [get_bd_pins m02_sc2axi/aclk] [get_bd_pins m02_nodes/m_axi_aclk] [get_bd_pins m02_exit_pipeline/aclk]
connect_bd_net -net m_axi_aresetn_2 [get_bd_pins clk_map/M02_ARESETN] [get_bd_pins m02_nodes/m_axi_aresetn] [get_bd_pins m02_exit_pipeline/aresetn]

validate_bd_design
save_bd_design
